# EAGLE design Nutriente_superior (EAGLE 7.6.0)
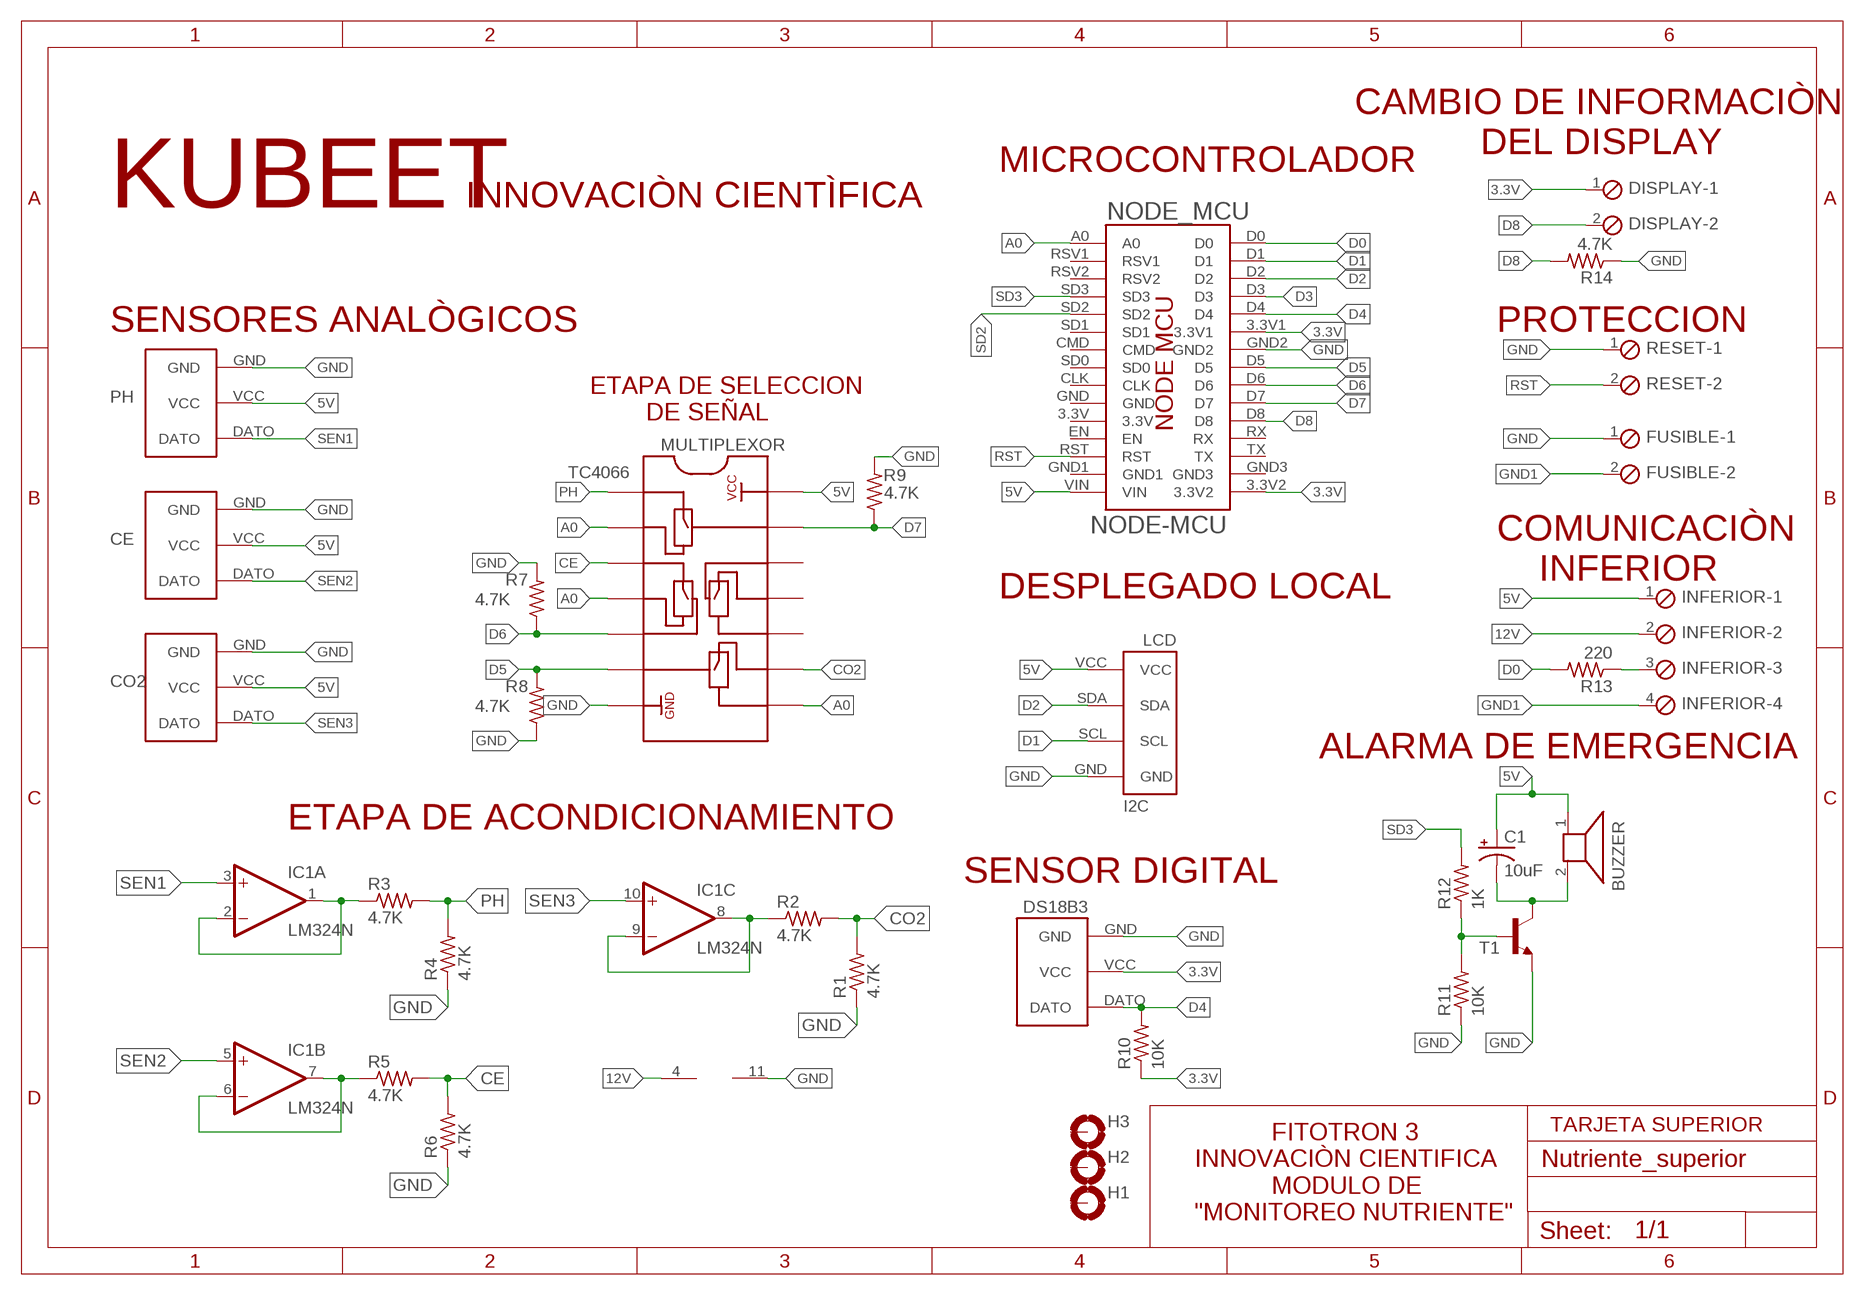
[diagram p0: schematic, sheet 1]

## Parts
BUZZER  AL60P  [AL60P]
C1  10uF  CPOL-USE2.5-6  [E2,5-6]
CE  BASE  [BASE]
CO2  BASE  [BASE]
DISPLAY  MPT2  [2POL254]
DS18B3  BASE  [BASE]
FUSIBLE  MPT2  [2POL254]
H1  MOUNT-PAD-ROUND3.0  [3,0-PAD]
H2  MOUNT-PAD-ROUND3.0  [3,0-PAD]
H3  MOUNT-PAD-ROUND3.0  [3,0-PAD]
IC1  LM324N  [DIL14]
INFERIOR  MPT4  [4POL254]
LCD  I2C  [I2C]
MULTIPLEXOR  TC4066  [TC4066]
NODE_MCU  NODE-MCU  [NODE-MCU]
PH  BASE  [BASE]
R1  4.7K  R-US_0207/7  [0207/7]
R2  4.7K  R-US_0207/7  [0207/7]
R3  4.7K  R-US_0207/7  [0207/7]
R4  4.7K  R-US_0207/7  [0207/7]
R5  4.7K  R-US_0207/7  [0207/7]
R6  4.7K  R-US_0207/7  [0207/7]
R7  4.7K  R-US_0207/7  [0207/7]
R8  4.7K  R-US_0207/7  [0207/7]
R9  4.7K  R-US_0207/7  [0207/7]
R10  10K  R-US_0207/7  [0207/7]
R11  10K  R-US_0207/7  [0207/7]
R12  1K  R-US_0207/7  [0207/7]
R13  220  R-US_0207/10  [0207/10]
R14  4.7K  R-US_0207/7  [0207/7]
RESET  MPT2  [2POL254]
T1  2N2222-NPN-TO92-EBC  [TO92-EBC]

## Nets
3.3V: DISPLAY.1 DS18B3.VCC NODE_MCU.3.3V1 NODE_MCU.3.3V2 R10.1
5V: BUZZER.1 C1.+ CE.VCC CO2.VCC INFERIOR.1 LCD.VCC MULTIPLEXOR.14 NODE_MCU.VIN PH.VCC
12V: IC1.4(P:V+) INFERIOR.2
A0: MULTIPLEXOR.2 MULTIPLEXOR.4 MULTIPLEXOR.8 NODE_MCU.A0
CE: MULTIPLEXOR.3 R5.2 R6.2
CO2: MULTIPLEXOR.9 R1.2 R2.2
D0: NODE_MCU.D0 R13.2
D1: LCD.SCL NODE_MCU.D1
D2: LCD.SDA NODE_MCU.D2
D3: NODE_MCU.D3
D4: DS18B3.DATO NODE_MCU.D4 R10.2
D5: MULTIPLEXOR.6 NODE_MCU.D5 R8.2
D6: MULTIPLEXOR.5 NODE_MCU.D6 R7.1
D7: MULTIPLEXOR.13 NODE_MCU.D7 R9.1
D8: DISPLAY.2 NODE_MCU.D8 R14.2
GND: CE.GND CO2.GND DS18B3.GND FUSIBLE.1 IC1.11(P:V-) LCD.GND MULTIPLEXOR.7 NODE_MCU.GND2 PH.GND R1.1 R4.1 R6.1 R7.2 R8.1 R9.2 R11.1 R14.1 RESET.1 T1.E
GND1: FUSIBLE.2 INFERIOR.4
N$1: IC1.8(C:OUT) IC1.9(C:-IN) R2.1
N$2: R11.2 R12.1 T1.B
N$4: BUZZER.2 C1.- T1.C
N$6: INFERIOR.3 R13.1
N$8: IC1.1(A:OUT) IC1.2(A:-IN) R3.1
N$14: IC1.6(B:-IN) IC1.7(B:OUT) R5.1
PH: MULTIPLEXOR.1 R3.2 R4.2
RST: NODE_MCU.RST RESET.2
SD2: NODE_MCU.SD2
SD3: NODE_MCU.SD3 R12.2
SEN1: IC1.3(A:+IN) PH.DATO
SEN2: CE.DATO IC1.5(B:+IN)
SEN3: CO2.DATO IC1.10(C:+IN)
Unconnected: H1.B3,0(MOUNT) H2.B3,0(MOUNT) H3.B3,0(MOUNT) IC1.12(D:+IN) IC1.13(D:-IN) IC1.14(D:OUT) MULTIPLEXOR.10 MULTIPLEXOR.11 MULTIPLEXOR.12 NODE_MCU.3.3V NODE_MCU.CLK NODE_MCU.CMD NODE_MCU.EN NODE_MCU.GND NODE_MCU.GND1 NODE_MCU.GND3 NODE_MCU.RSV1 NODE_MCU.RSV2 NODE_MCU.RX NODE_MCU.SD0 NODE_MCU.SD1 NODE_MCU.TX

## Notes on the sheet
- CAMBIO DE INFORMACIÒN 
              DEL DISPLAY
- MICROCONTROLADOR
- KUBEET | INNOVACIÒN CIENTÌFICA
- SENSORES ANALÒGICOS | PROTECCION
- ETAPA DE SELECCION
          DE SEÑAL
- COMUNICACIÒN 
      INFERIOR
- DESPLEGADO LOCAL
- ALARMA DE EMERGENCIA
- ETAPA DE ACONDICIONAMIENTO
- SENSOR DIGITAL
- TARJETA SUPERIOR
- FITOTRON 3
  INNOVACIÒN CIENTIFICA
             MODULO DE 
  "MONITOREO NUTRIENTE"

## Library data of the parts
BUZZER = buzzer:AL60P: SPEAKER Source: Buerklin; OC_FARNELL: unknown; OC_NEWARK: unknown
C1 = rcl:CPOL-US: POLARIZED CAPACITOR, American symbol
CE CO2 DS18B3 PH = Sensores y transmisores:BASE
DISPLAY FUSIBLE RESET = con-phoenix-254:MPT2: PHOENIX CONNECTOR; OC_FARNELL: unknown; OC_NEWARK: unknown
H1-H3 = holes:MOUNT-PAD-ROUND: MOUNTING PAD, round
IC1 = linear:LM324: OP AMP
INFERIOR = con-phoenix-254:MPT4: PHOENIX CONNECTOR; OC_FARNELL: unknown; OC_NEWARK: unknown
LCD = CONECTORES RODAS:I2C
MULTIPLEXOR = CONECTORES RODAS:TC4066
NODE_MCU = Arduinos:NODE-MCU
R1-R14 = rcl:R-US_: RESISTOR, American symbol
T1 = transistor-neu-to92:*-NPN-: NPN Transistror

## Board
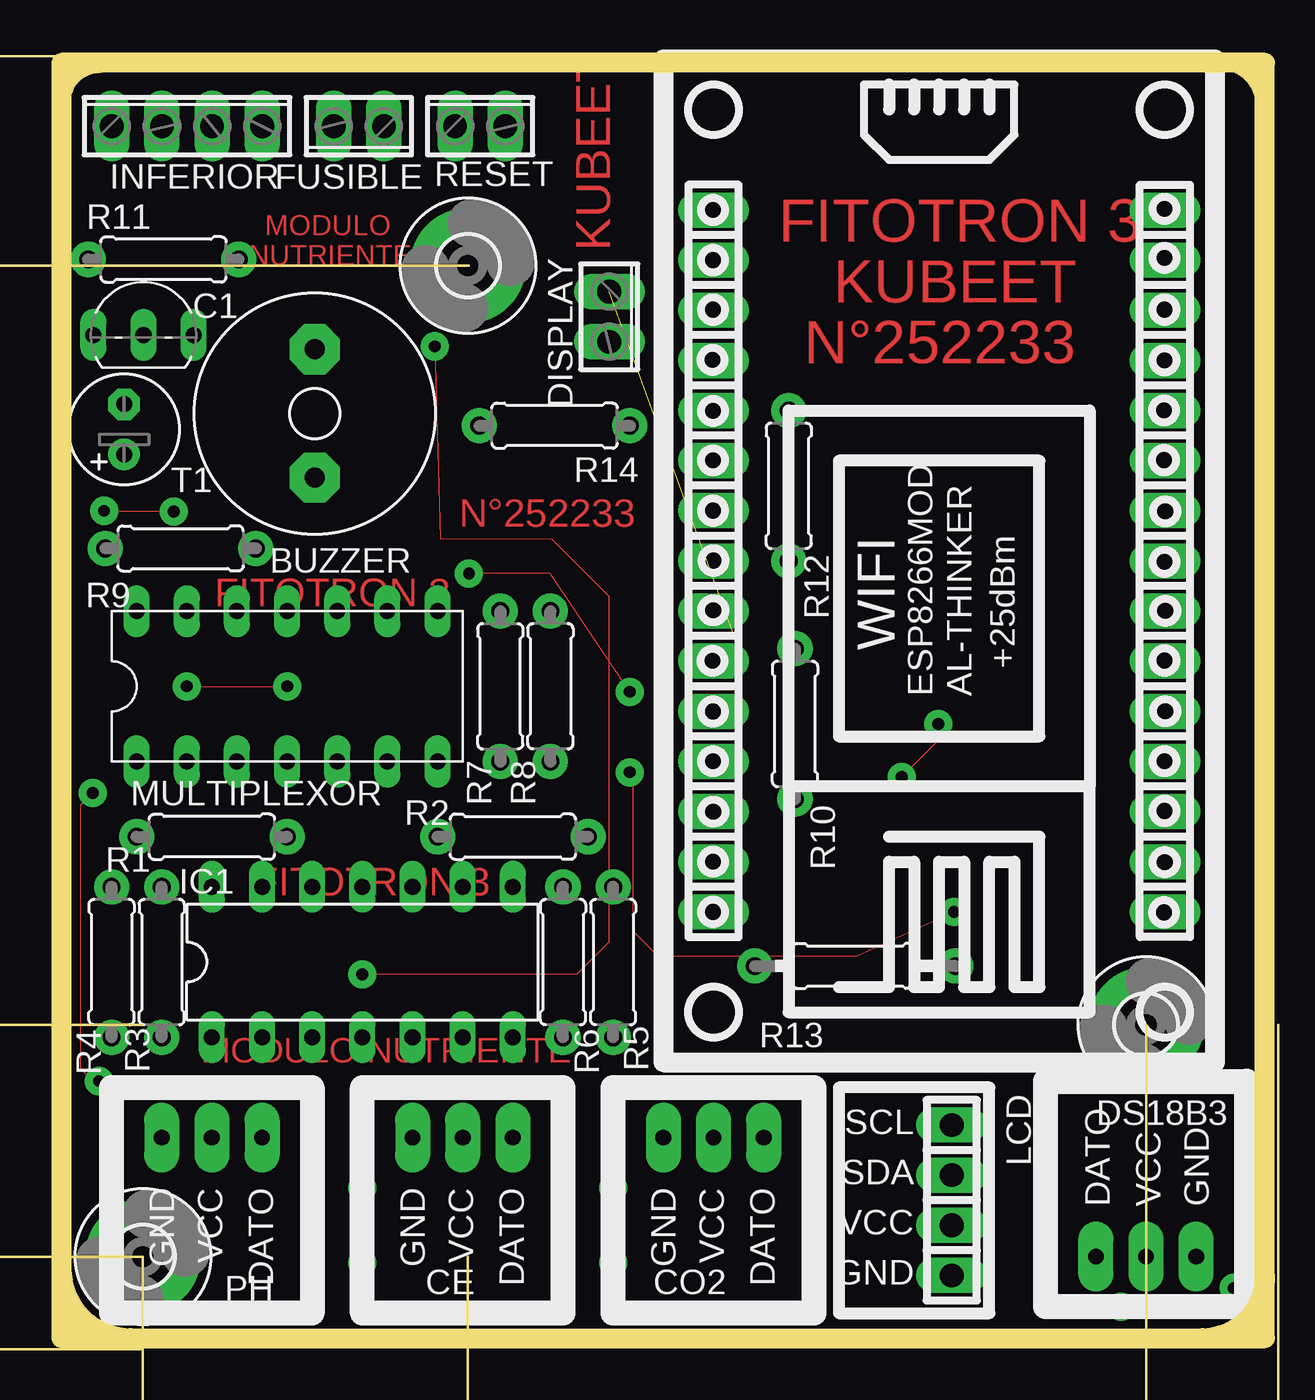
[diagram p1: board, top side]
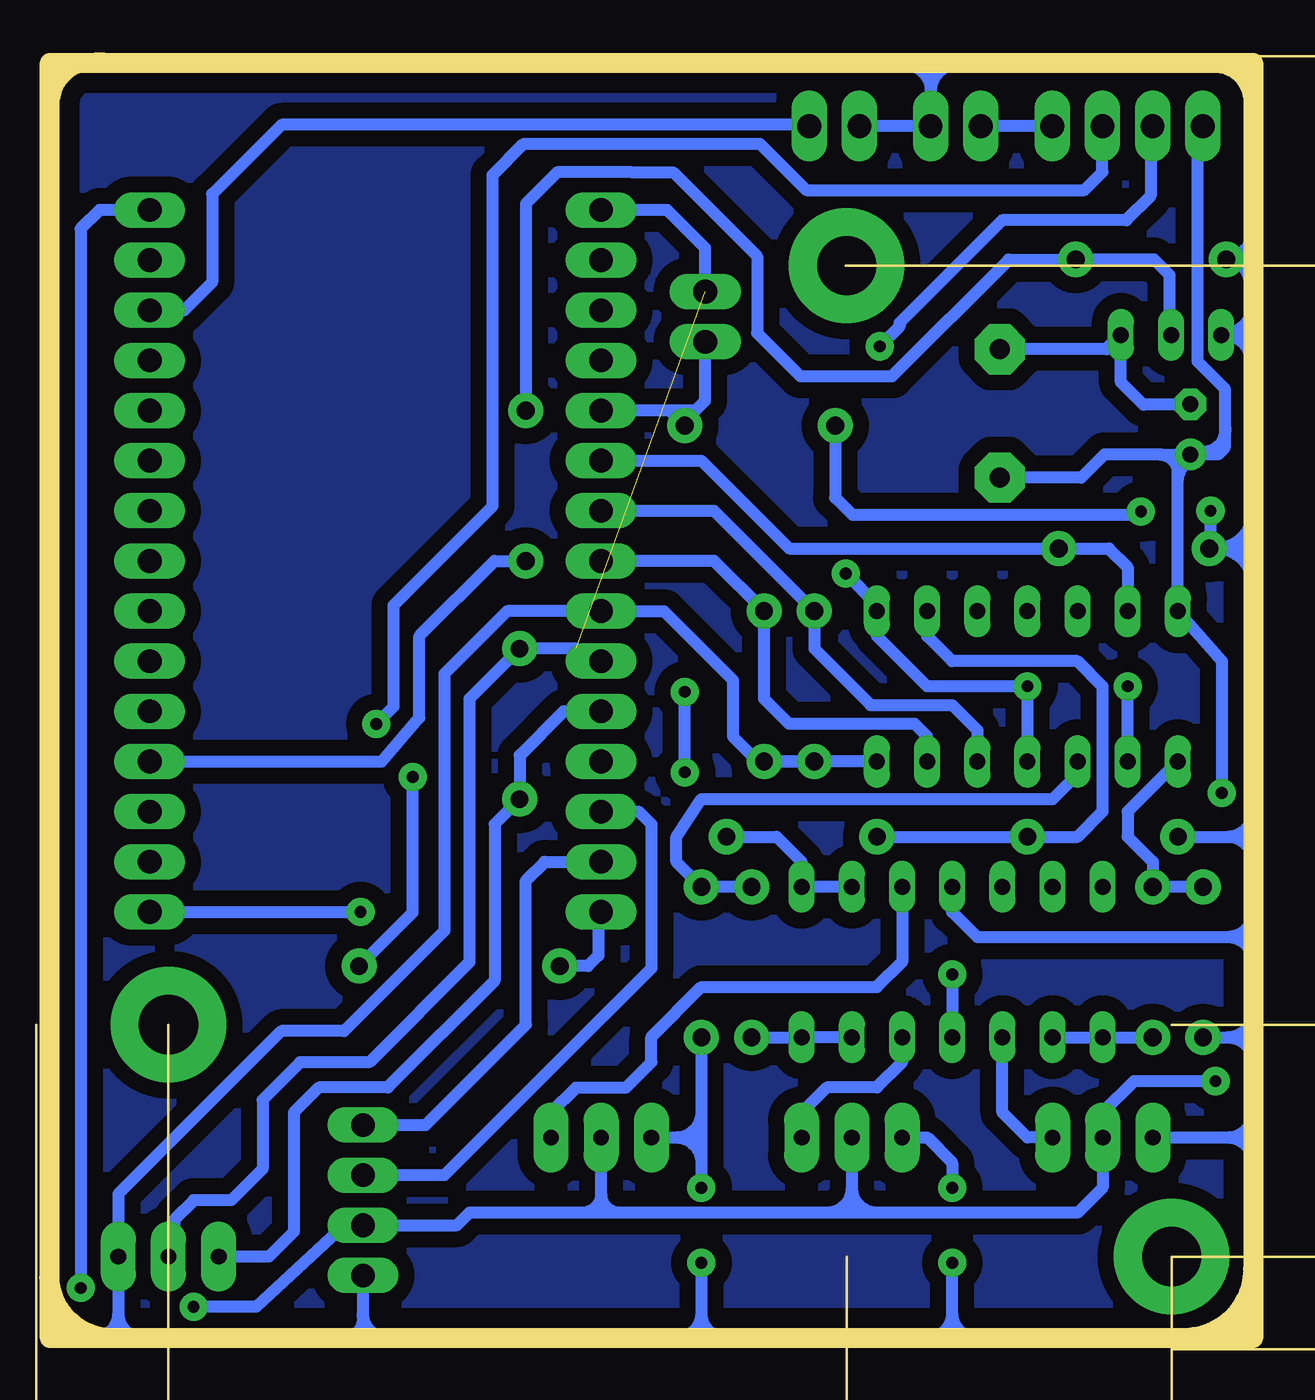
[diagram p2: board, bottom side, seen from below]

Size 60.96 x 64.62 mm. Coordinates in mm from the lower left corner, seen from the top.
Outline: 0.64,0 0,0 0,3.49
Outline: 0.64,0 3.49,0
Outline: 3.49,0 57.78,0
Outline: 57.78,0 60.94,0 60.94,64.61 0,64.61 0,3.49
Outline: 0,3.49 arc90 3.49,0
Outline: 0.64,0.64 0.64,0
Outline: 57.78,0 arc90 60.96,3.17
Outline: 60.64,0.32 arc90 60.33,0.64
Outline: 58.25,64.62 58.56,64.62
Outline: 0.18,62.14 0.18,62.62 arc-90 1.95,64.4
Outline: 58.49,64.58 58.63,64.58 arc-90 60.77,62.43
Copper layers (1*16): Top 0.035mm / dielectric 1.5mm / Bottom 0.035mm
Design rules "default": minimum track width 10mil, minimum drill 24mil, track to track 8mil, track to pad 8mil, pad to pad 8mil, via to via 8mil, smd to smd 8mil, copper to edge 40mil, drill to drill 8mil, minimum pad ring 10mil, minimum via ring 8mil, stop-mask expansion 4mil, vias tented up to drill 0mil, thermal gap 10mil
Milling: area -20.4,4.1 to -19.8,5.6; area -20.4,52.8 to -19.8,54.3; area -22.3,26.5 to -20.5,32; area -13.8,4.1 to -13.2,5.6; area -13.8,14.4 to -13.2,15.9; area -15.7,6.5 to -13.9,13.5; area 4.1,-13.9 to 5.6,-13.3; area 53.4,-13.9 to 54.9,-13.3; area 26.8,-13.2 to 32.3,-11.4; area 4.1,-6.7 to 5.6,-6.1; area 19.1,-6.7 to 20.6,-6.1; area 8.9,-6 to 15.8,-4.2; 9 more areas; 21 lines

### Footprints (pad centres in the part's own frame; a part is rotated, then mirrored left to right if it is on the bottom)
AL60P = drill 1.016 pad 2.54 octagon: 1 -3.251,0; 2 3.251,0
E2,5-6 = drill 0.813 pad 1.6: + -1.27,0 | drill 0.813 pad 1.6 octagon: - 1.27,0
BASE = drill 0.8 pad 1.778 long: DATO 2.54,1.27; GND 7.62,1.27; VCC 5.08,1.27
2POL254 = drill 1.2 long: 1 -1.27,0; 2 1.27,0
3,0-PAD = drill 3 pad 5.842: B3,0 0,0
DIL14 = drill 0.813 long: 1 -7.62,-3.81; 2 -5.08,-3.81; 3 -2.54,-3.81; 4 0,-3.81; 5 2.54,-3.81; 6 5.08,-3.81; 7 7.62,-3.81; 8 7.62,3.81; 9 5.08,3.81; 10 2.54,3.81; 11 0,3.81; 12 -2.54,3.81; 13 -5.08,3.81; 14 -7.62,3.81
4POL254 = drill 1.2 long: 1 -3.81,0; 2 -1.27,0; 3 1.27,0; 4 3.81,0
I2C = drill 1.2 pad 1.676 long: GND 1.905,9.525; SCL 1.905,1.905; SDA 1.905,4.445; VCC 1.905,6.985
TC4066 = drill 0.813 long: 1 -7.62,-3.81; 2 -5.08,-3.81; 3 -2.54,-3.81; 4 0,-3.81; 5 2.54,-3.81; 6 5.08,-3.81; 7 7.62,-3.81; 8 7.62,3.81; 9 5.08,3.81; 10 2.54,3.81; 11 0,3.81; 12 -2.54,3.81; 13 -5.08,3.81; 14 -7.62,3.81
NODE-MCU = drill 1.2 pad 1.676 long: 3.3V 2.54,17.78; 3.3V1 25.4,30.48; 3.3V2 25.4,7.62; A0 2.54,43.18; CLK 2.54,22.86; CMD 2.54,27.94; D0 25.4,43.18; D1 25.4,40.64; D2 25.4,38.1; D3 25.4,35.56; D4 25.4,33.02; D5 25.4,25.4; D6 25.4,22.86; D7 25.4,20.32; D8 25.4,17.78; EN 2.54,15.24; GND 2.54,20.32; GND1 2.54,10.16; GND2 25.4,27.94; GND3 25.4,10.16; RST 2.54,12.7; RSV1 2.54,40.64; RSV2 2.54,38.1; RX 25.4,15.24; SD0 2.54,25.4; SD1 2.54,30.48; SD2 2.54,33.02; SD3 2.54,35.56; TX 25.4,12.7; VIN 2.54,7.62
0207/7 = drill 0.9 pad 1.778: 1 -3.81,0; 2 3.81,0
0207/10 = drill 0.9 pad 1.778: 1 -5.08,0; 2 5.08,0
TO92-EBC = drill 0.813 long: B 0,-1.27; C 2.54,-1.27; E -2.54,-1.27

### Placement (x,y rotation side)
BUZZER  12.83,46.84 90 top
C1  3.17,46.04 90 top
CE  25.4,11.43 180 top
CO2  38.1,11.43 180 top
DISPLAY  27.75,51.74 270 top
DS18B3  49.85,2.86 0 top
FUSIBLE  15.06,61.4 180 top
H1  20.59,54.33 0 top
H2  54.93,15.88 0 top
H3  4.13,4.13 0 top
IC1  15.24,19.05 0 top
INFERIOR  6.36,61.4 0 top
LCD  46.99,12.7 180 top
MULTIPLEXOR  11.43,33.02 0 top
NODE_MCU  58.42,64.77 180 top
PH  12.7,11.43 180 top
R1  7.62,25.4 0 top
R2  22.86,25.4 180 top
R3  5.08,19.05 90 top
R4  2.54,19.05 90 top
R5  25.4,19.05 90 top
R6  27.94,19.05 90 top
R7  22.23,33.02 270 top
R8  24.77,33.02 90 top
R9  6.03,40.01 180 top
R10  37.15,31.11 270 top
R11  5.17,54.65 0 top
R12  36.83,43.18 270 top
R13  40.2,18.85 180 top
R14  24.98,46.22 0 top
RESET  21.21,61.4 0 top
T1  4.16,52.09 0 top

### Tracks (layer width: path | path; a pad name or v marks a point on that pad's centre or on a via)
3.3V  (1 unrouted)
  Bottom 0.61: DS18B3.VCC 54.61,4.45 54.61,6.03 53.66,6.99 51.75,6.99 50.16,8.57 50.16,12.06 48.26,13.97 44.77,13.97 39.69,19.05 39.69,32.38 R10.1 34.29,34.92 33.34,33.97 NODE_MCU.3.3V1 | DISPLAY.1 27.75,55.22 29.68,57.15 NODE_MCU.3.3V2
5V  (via drill 0.6 pad 1.42)
  Top 0: v59.37,2.54 58.1,1.59 v53.66,1.59 | v1.59,27.62 0.95,26.99 0.95,13.65 1.59,13.02 v1.91,13.02
  Bottom 0.61: 19.05,6.35 8.89,6.35 7.62,7.62 PH.VCC 7.62,11.43 6.03,13.02 v1.91,13.02 | 19.05,6.35 20.32,6.35 | 20.32,6.35 21.59,6.35 | 21.59,6.35 32.07,6.35 | 32.07,6.35 33.02,6.35 | 33.02,6.35 33.97,6.35 | 33.97,6.35 39.69,6.35 40.32,5.71 LCD.VCC 46.04,5.71 50.48,1.59 v53.66,1.59 | 33.02,6.35 33.02,7.3 | 33.02,7.3 CO2.VCC | CE.VCC 20.32,7.62 | 20.32,7.62 20.32,6.35 | 19.05,6.35 arc90 20.32,7.62 | 20.32,7.62 arc90 21.59,6.35 | 32.07,6.35 arc90 33.02,7.3 | 33.02,7.3 arc90 33.97,6.35 | NODE_MCU.VIN 58.42,57.15 59.37,56.2 v59.37,2.54 | v1.59,27.62 1.59,34.29 MULTIPLEXOR.14 3.81,43.5 | 4.76,44.77 3.81,44.77 | 3.81,44.77 C1.+ 1.77,44.77 1.44,45.09 1.44,48.11 2.83,49.49 2.83,61.12 INFERIOR.1 | 3.81,43.5 3.81,43.81 | 3.81,43.81 3.81,44.77 | 4.76,44.77 arc90 3.81,43.81 | 2.86,44.45 arc-90 3.81,43.5 | 4.76,44.77 4.78,44.78 7.52,44.78 8.71,43.59 BUZZER.1
12V  (via drill 0.6 pad 1.42)
  Top 0: v18.91,50.24 19.19,40.5 24.84,40.47 27.72,37.59 27.72,20.05 26.1,18.43 v15.24,18.43
  Bottom 0.61: v15.24,18.43 IC1.4 | INFERIOR.2 5.2,61.29 5.2,57.86 6.43,56.63 12.71,56.63 17.9,51.43 17.9,51.25 v18.91,50.24
A0  (via drill 0.6 pad 1.42)
  Top 0: v6.35,33.02 v11.43,33.02 | v45.2,21.59 40.32,19.37 30.19,19.37 28.94,20.62 28.94,28.5 v28.77,28.66 | v28.77,32.74 24.77,38.73 v20.64,38.73
  Bottom 0.61: MULTIPLEXOR.2 v6.35,33.02 | MULTIPLEXOR.4 v11.43,33.02 16.51,33.02 19.05,35.56 MULTIPLEXOR.8 19.05,37.15 v20.64,38.73 | NODE_MCU.A0 v45.2,21.59 | v28.77,28.66 v28.77,32.74
CE
  Bottom 0.61: R5.2 R6.2 29.21,24.13 29.21,25.4 27.94,27.3 10.16,27.3 8.89,28.57 MULTIPLEXOR.3
CO2
  Bottom 0.61: R2.2 R1.2 8.89,25.4 7.62,26.67 7.62,33.02 8.89,34.29 15.24,34.29 16.51,35.56 MULTIPLEXOR.9
D0
  Bottom 0.61: NODE_MCU.D0 33.16,21.45 33.16,19.38 33.69,18.85 R13.2
D1
  Bottom 0.61: LCD.SCL 41.91,10.79 36.83,15.88 36.83,23.18 35.88,24.13 NODE_MCU.D1
D2
  Bottom 0.61: NODE_MCU.D2 31.11,26.67 30.48,26.04 30.48,18.73 40.96,8.26 LCD.SDA
D4
  Bottom 0.61: NODE_MCU.D4 34.92,31.75 37.15,29.53 R10.2 38.42,26.04 38.42,18.1 43.81,12.7 47.31,12.7 48.58,11.43 48.58,5.4 49.85,4.13 DS18B3.DATO
D5
  Bottom 0.61: MULTIPLEXOR.6 16.51,30.48 17.14,31.11 23.5,31.11 24.77,32.38 R8.2 27.3,39.37 NODE_MCU.D5
D6
  Bottom 0.61: MULTIPLEXOR.5 13.97,30.8 15.24,32.07 19.37,32.07 22.23,34.92 R7.1 27.3,41.91 NODE_MCU.D6
D7
  Bottom 0.61: MULTIPLEXOR.13 6.35,39.05 7.3,40.01 R9.1 23.5,40.01 27.94,44.45 NODE_MCU.D7
D8
  Bottom 0.61: R14.2 29.55,46.99 | 29.55,46.99 29.7,46.99 NODE_MCU.D8 | DISPLAY.2 27.77,50.45 27.77,47.48 28.25,46.99 29.55,46.99
GND  (via drill 0.6 pad 1.42)
  Top 0: v27.94,7.62 v27.94,3.81 | v15.24,3.81 v15.24,7.62 | v5.68,41.88 2.19,41.88 v2.16,41.91
  Bottom 0.406: 0,49.57 0.14,49.57 0.14,48.03
  Bottom 0.61: R4.1 1.27,15.24 | 1.27,15.24 0,15.24 0,13.97 | 0,13.97 0,11.43 | 0,11.43 0,10.16 | 0,10.16 1.27,10.16 | v27.94,3.81 27.94,1.27 | 27.94,1.27 27.94,0 26.67,0 | 26.67,0 16.51,0 | 16.51,0 15.24,0 15.24,1.27 | 15.24,1.27 v15.24,3.81 | CE.GND 16.51,10.16 15.24,8.89 v15.24,7.62 | 15.24,1.27 arc-90 13.97,0 0,0 0,10.16 | 15.24,1.27 arc90 16.51,0 | 26.67,0 arc90 27.94,1.27 | 27.94,1.27 arc90 29.21,0 43.81,0 | 0,11.43 arc90 1.27,10.16 | 1.27,10.16 arc90 0,8.89 | 1.27,15.24 arc-90 0,16.51 0,19.05 | 1.27,15.24 arc90 0,13.97 | IC1.11 15.24,21.59 13.97,20.32 1.27,20.32 | 1.27,20.32 0,20.32 0,19.05 | 1.27,20.32 arc-90 0,21.59 0,24.13 | 1.27,20.32 arc90 0,19.05 | R6.1 27.94,11.43 | 27.94,11.43 27.94,10.16 | 27.94,10.16 27.94,8.89 | 27.94,8.89 v27.94,7.62 | CO2.GND 29.21,10.16 | 29.21,10.16 27.94,10.16 | 27.94,11.43 arc90 29.21,10.16 | 29.21,10.16 arc90 27.94,8.89 | PH.GND 1.27,10.16 | R1.1 1.27,25.4 | 1.27,25.4 0,25.4 0,24.13 | 1.27,25.4 arc-90 0,26.67 0,38.1 | 1.27,25.4 arc90 0,24.13 | MULTIPLEXOR.7 R8.1 | R8.1 R7.2 | 1.91,40.01 0.32,40.01 0,39.69 | 0,39.69 0,38.1 | 1.91,40.01 R9.2 2.16,40.07 v2.16,41.91 | 1.91,40.01 arc-90 0,41.91 | 0,41.91 0,39.69 | 0,38.1 arc-90 1.91,40.01 | 57.47,1.27 DS18B3.GND 57.47,7.3 49.21,15.56 46.04,15.56 40.96,20.64 40.96,33.66 37.78,36.83 NODE_MCU.GND2 29.84,36.83 26.35,33.34 26.35,30.48 25.08,29.21 R8.1 | 57.47,1.27 57.47,0 56.2,0 | 56.2,0 46.04,0 | 46.04,0 45.09,0 | 45.09,0 43.81,0 | 56.2,0 arc90 57.47,1.27 | 57.47,1.27 arc90 58.74,0 | LCD.GND 45.09,1.27 | 45.09,0.95 45.09,0 | 43.81,0 arc90 45.09,1.27 | 45.09,1.27 45.09,0.95 | 45.09,0.95 arc90 46.04,0 | 0,54.85 0,50.86 | 0,50.86 0,49.57 0,41.91 | 0.14,48.03 0.14,47.86 | T1.E 1.58,50.86 0,50.86
  Bottom 0.61: R11.1 1.15,54.85 0,54.85 | RESET.1 FUSIBLE.1 16.33,64.5 16.15,64.68 0.2,64.68 0,64.47 0,54.85 | R14.1 21.17,42.58 20.3,41.71 5.85,41.71 v5.68,41.88
GND1
  Bottom 0.61: INFERIOR.4 FUSIBLE.2
N$1
  Bottom 0.61: IC1.9 IC1.8 22.86,24.13 24.13,25.4 R2.1
N$2
  Bottom 0.61: R12.1 36.83,57.47 35.24,59.05 31.43,59.05 31.43,59.06 29.38,59.06 25.12,54.8 25.12,50.92 22.92,48.73 18.3,48.73 12.38,54.65 R11.2 5.02,54.65 4.23,53.86 4.23,50.9 T1.B
N$3
  Bottom 0.61: 0.07,52.27 arc90 1.46,50.88 1.58,50.88 arc90 0.11,49.41 0.11,49.32
N$4
  Bottom 0.61: C1.- 3.19,47.29 5.56,47.29 6.7,48.43 T1.C 7.43,50.09 BUZZER.2
N$5
  Bottom 0.61: 0.02,56.09 arc90 1.39,54.72 1.51,54.72 arc90 0.17,53.38 0.17,53.11
N$6  (via drill 0.6 pad 1.42)
  Top 0: v42.56,28.43 44.41,30.28 v44.41,31.11
  Bottom 0.61: R13.1 42.56,21.56 42.56,27.25 v42.56,28.43 | v44.41,31.11 43.53,31.99 43.53,37.13 38.51,42.15 38.51,58.92 36.92,60.51 24.98,60.51 22.63,58.16 8.54,58.16 7.63,59.07 INFERIOR.3
N$7
  Bottom 0.61: 14.92,64.5 15.01,64.5 arc-90 16.31,63.2 arc-90 17.59,64.48 17.89,64.48
N$8
  Bottom 0.61: IC1.2 IC1.1 R3.1
N$9
  Bottom 0.61: 1.42,46.14 1.42,46 arc90 2.52,44.89
N$10
  pour Bottom (isolate 0.813): 0.24,0.24 61.07,0.24 61.07,64.61 0.12,64.61 0.12,2.27
N$14
  Bottom 0.61: IC1.6 IC1.7 R5.1
PH
  Bottom 0.61: R4.2 R3.2 5.08,24.13 6.35,25.4 6.35,26.67 MULTIPLEXOR.1
RST
  Bottom 0.61: RESET.2 22.54,61.46 49.2,61.46 52.71,57.95 52.71,53.49 54.13,52.07 NODE_MCU.RST
SD3
  Bottom 0.61: NODE_MCU.SD3 44.13,29.21 42.23,31.43 42.23,35.56 38.42,39.37 R12.2
SEN1
  Bottom 0.61: PH.DATO 11.43,10.16 12.7,11.43 IC1.3
SEN2
  Bottom 0.61: IC1.5 17.78,13.97 19.05,12.7 21.59,12.7 22.86,11.43 CE.DATO
SEN3
  Bottom 0.61: IC1.10 17.78,19.05 19.05,17.78 27.94,17.78 30.48,15.24 30.48,13.97 31.75,12.7 34.29,12.7 35.56,11.43 CO2.DATO

### Text on the board
Top: FITOTRON 3 | KUBEET | MODULO / NUTRIENTE | KUBEET | N°252233 | N°252233 | FITOTRON 3 | FITOTRON 3 | MODULO NUTRIENTE